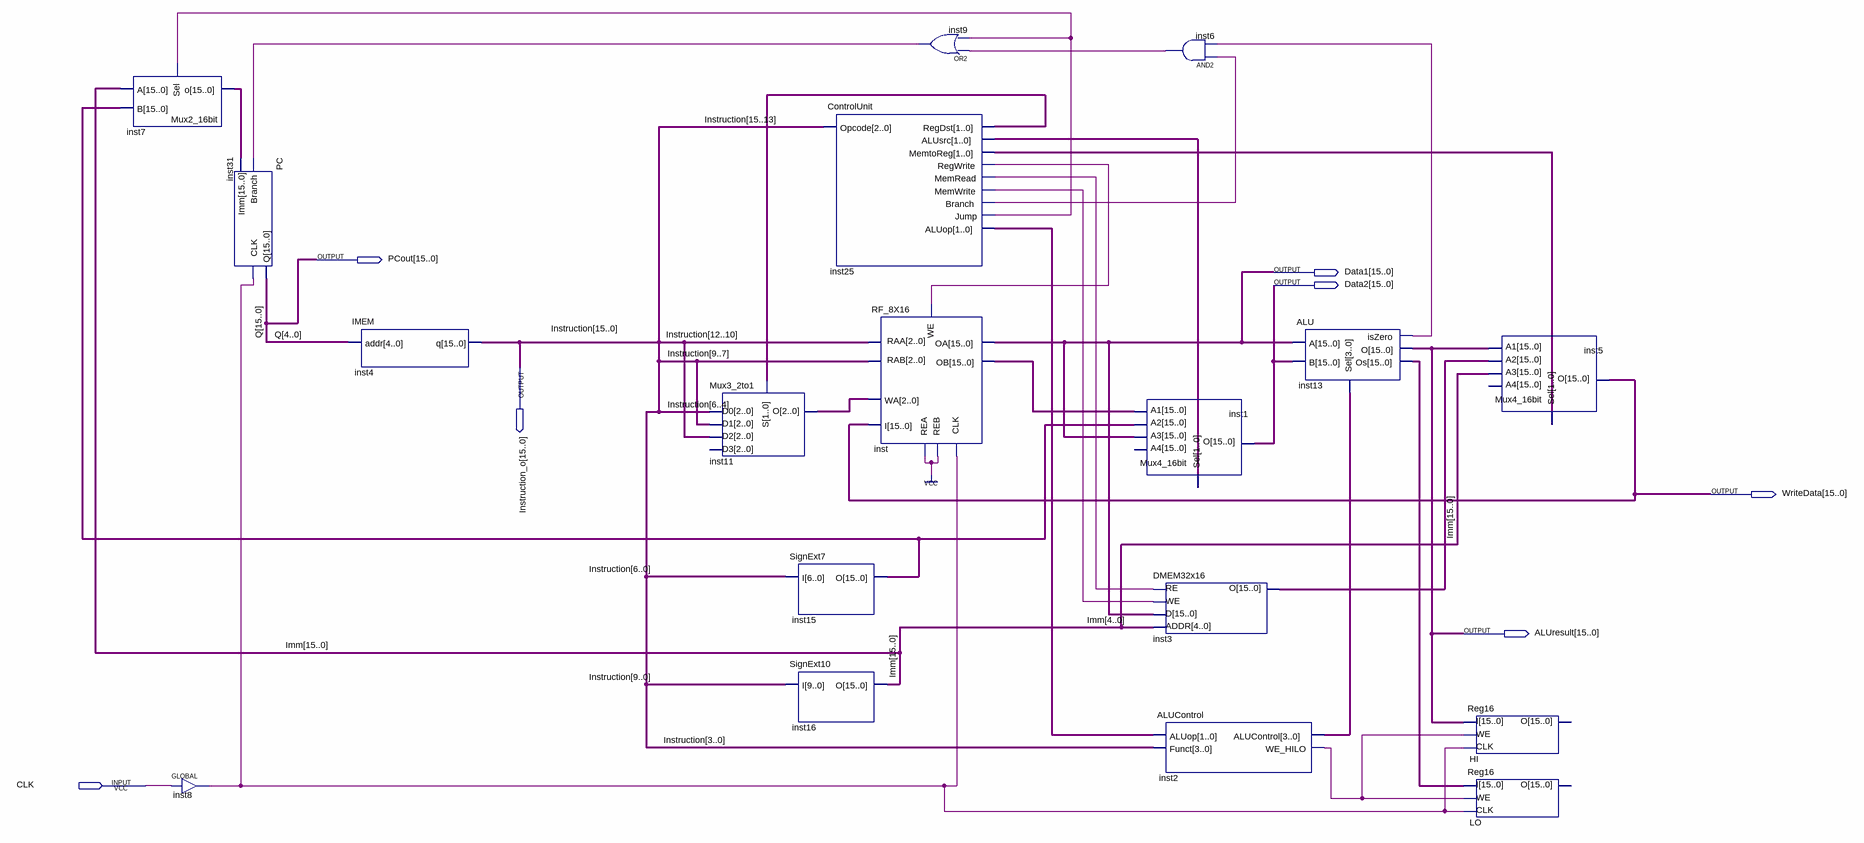
[diagram p0: schematic sheet]
// Quartus schematic CPUTopDesign_datt_tested.bdf as structural Verilog: 18 symbols, 7 pins
module CPUTopDesign_datt_tested (
  input  CLK,
  output [15:0] PCout,
  output [15:0] Data1,
  output [15:0] Data2,
  output [15:0] Instruction_o,
  output [15:0] WriteData,
  output [15:0] ALUresult
);

  wire inst2_we_hilo, inst6_out, inst8_out, inst9_out, inst13_iszero, inst25_branch, inst25_jump,
       inst25_memread, inst25_memwrite, inst25_regwrite;
  wire [1:0] inst25_aluop, inst25_alusrc, inst25_memtoreg, inst25_regdst;
  wire [2:0] inst11_o;
  wire [3:0] inst2_alucontrol;
  wire [15:0] Imm, inst3_o, inst7_o, inst13_os, inst15_o, inst_ob;

  Mux2_16bit inst7 (.Sel(inst25_jump), .A(Imm), .B(inst15_o), .o(inst7_o));
  GLOBAL inst8 (.IN(CLK), .OUT(inst8_out));
  PC inst31 (.Branch(inst9_out), .Imm(inst7_o), .CLK(inst8_out), .Q(PCout));
  IMEM inst4 (.addr(PCout[4:0]), .q(Instruction_o));
  Mux3_2to1 inst11 (
    .D0(Instruction_o[6:4]), .D1(Instruction_o[9:7]), .D2(Instruction_o[12:10]), .S(inst25_regdst),
    .O(inst11_o));  // open: D3
  SignExt7 inst15 (.I(Instruction_o[6:0]), .O(inst15_o));
  SignExt10 inst16 (.I(Instruction_o[9:0]), .O(Imm));
  ControlUnit inst25 (
    .Opcode(Instruction_o[15:13]), .RegDst(inst25_regdst), .ALUsrc(inst25_alusrc),
    .MemtoReg(inst25_memtoreg), .RegWrite(inst25_regwrite), .MemRead(inst25_memread),
    .MemWrite(inst25_memwrite), .Branch(inst25_branch), .Jump(inst25_jump), .ALUop(inst25_aluop));
  RF_8X16 inst (
    .I(WriteData), .WA(inst11_o), .WE(inst25_regwrite), .RAA(Instruction_o[12:10]), .REA(1'b1),
    .RAB(Instruction_o[9:7]), .REB(1'b1), .CLK(inst8_out), .OB(inst_ob), .OA(Data1));
  or inst9 (inst9_out, inst6_out, inst25_jump);
  Mux4_16bit inst1 (.Sel(inst25_alusrc), .A3(Data1), .A2(inst15_o), .A1(inst_ob), .O(Data2));  // open: A4
  DMEM32x16 inst3 (.RE(inst25_memread), .WE(inst25_memwrite), .D(Data1), .ADDR(Imm), .O(inst3_o));
  ALUControl inst2 (
    .ALUop(inst25_aluop), .Funct(Instruction_o[3:0]), .ALUControl(inst2_alucontrol), .WE_HILO(inst2_we_hilo));
  and inst6 (inst6_out, inst25_branch, inst13_iszero);
  ALU inst13 (.Sel(inst2_alucontrol), .A(Data1), .B(Data2), .O(ALUresult), .Os(inst13_os), .isZero(inst13_iszero));
  Reg16 HI (.WE(inst2_we_hilo), .CLK(inst8_out), .I(ALUresult));  // open: O
  Reg16 LO (.WE(inst2_we_hilo), .CLK(inst8_out), .I(inst13_os));  // open: O
  Mux4_16bit inst5 (.Sel(inst25_memtoreg), .A3(Imm), .A2(inst3_o), .A1(ALUresult), .O(WriteData));  // open: A4

  // Other names for the same wires on the sheet: Instruction[15:0] = Instruction_o; Q[15:0] = PCout
endmodule
